# Altium schematic sheet 01.Block Diagram.SchDoc
size A4
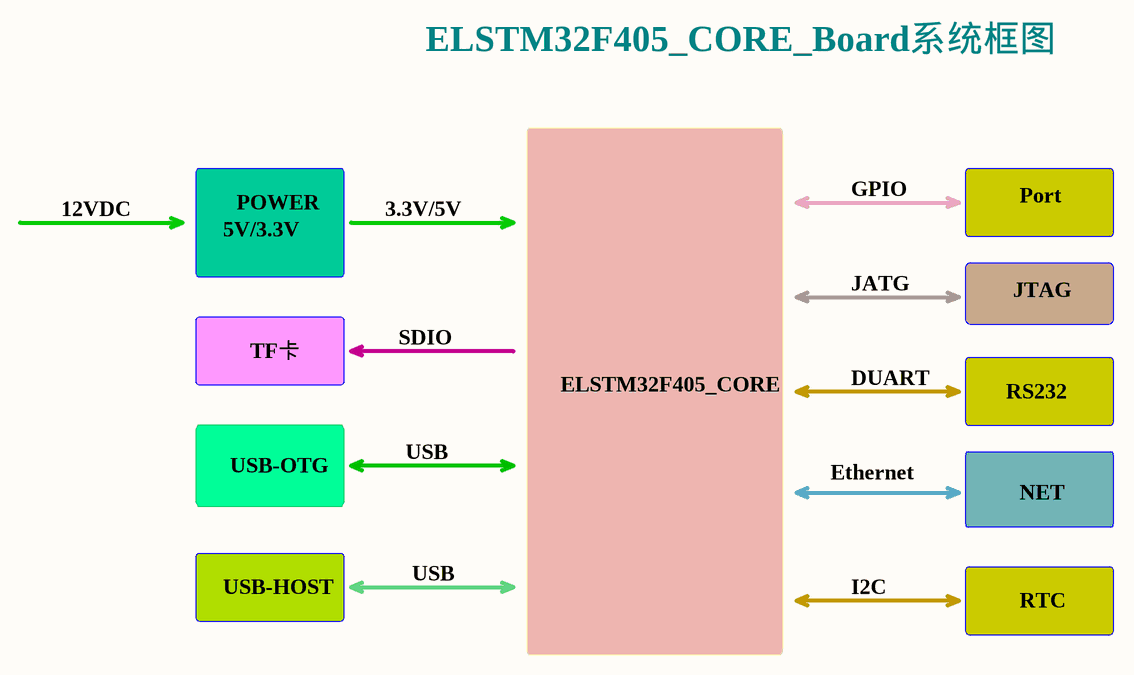
[diagram p0: 01.Block Diagram.SchDoc]

## Notes on the sheet
- ELSTM32F405_CORE_Board系统框图
- GPIO
- Port
- 12VDC
- 5V/3.3V
- POWER
- 3.3V/5V
- JATG
- JTAG
- TF卡
- SDIO
- ELSTM32F405_CORE
- DUART
- RS232
- USB-OTG
- USB
- Ethernet
- NET
- USB-HOST
- I2C
- RTC
- #
- 日期
- 描述
- DESIGN BY
- 设计人员
- 设计日期
- 图纸名称
- 图纸描述
- EasyLinker Develop Team
- 审核人员
- 审核日期
- 产品名称
- 产品型号
- 图纸版本
- /
- A4